# Altium schematic sheet 04_LMS7002M_Digital.SchDoc: LMS7002M digital circuit
size A3 portrait; Organization: Lime Microsystems; Address1: Surrey Tech Centre; Address2: Guildford GU2 7YG; Address3: Surrey; Address4: United Kingdom; Revision: v1.2; SheetNumber: 4; SheetTotal: 14
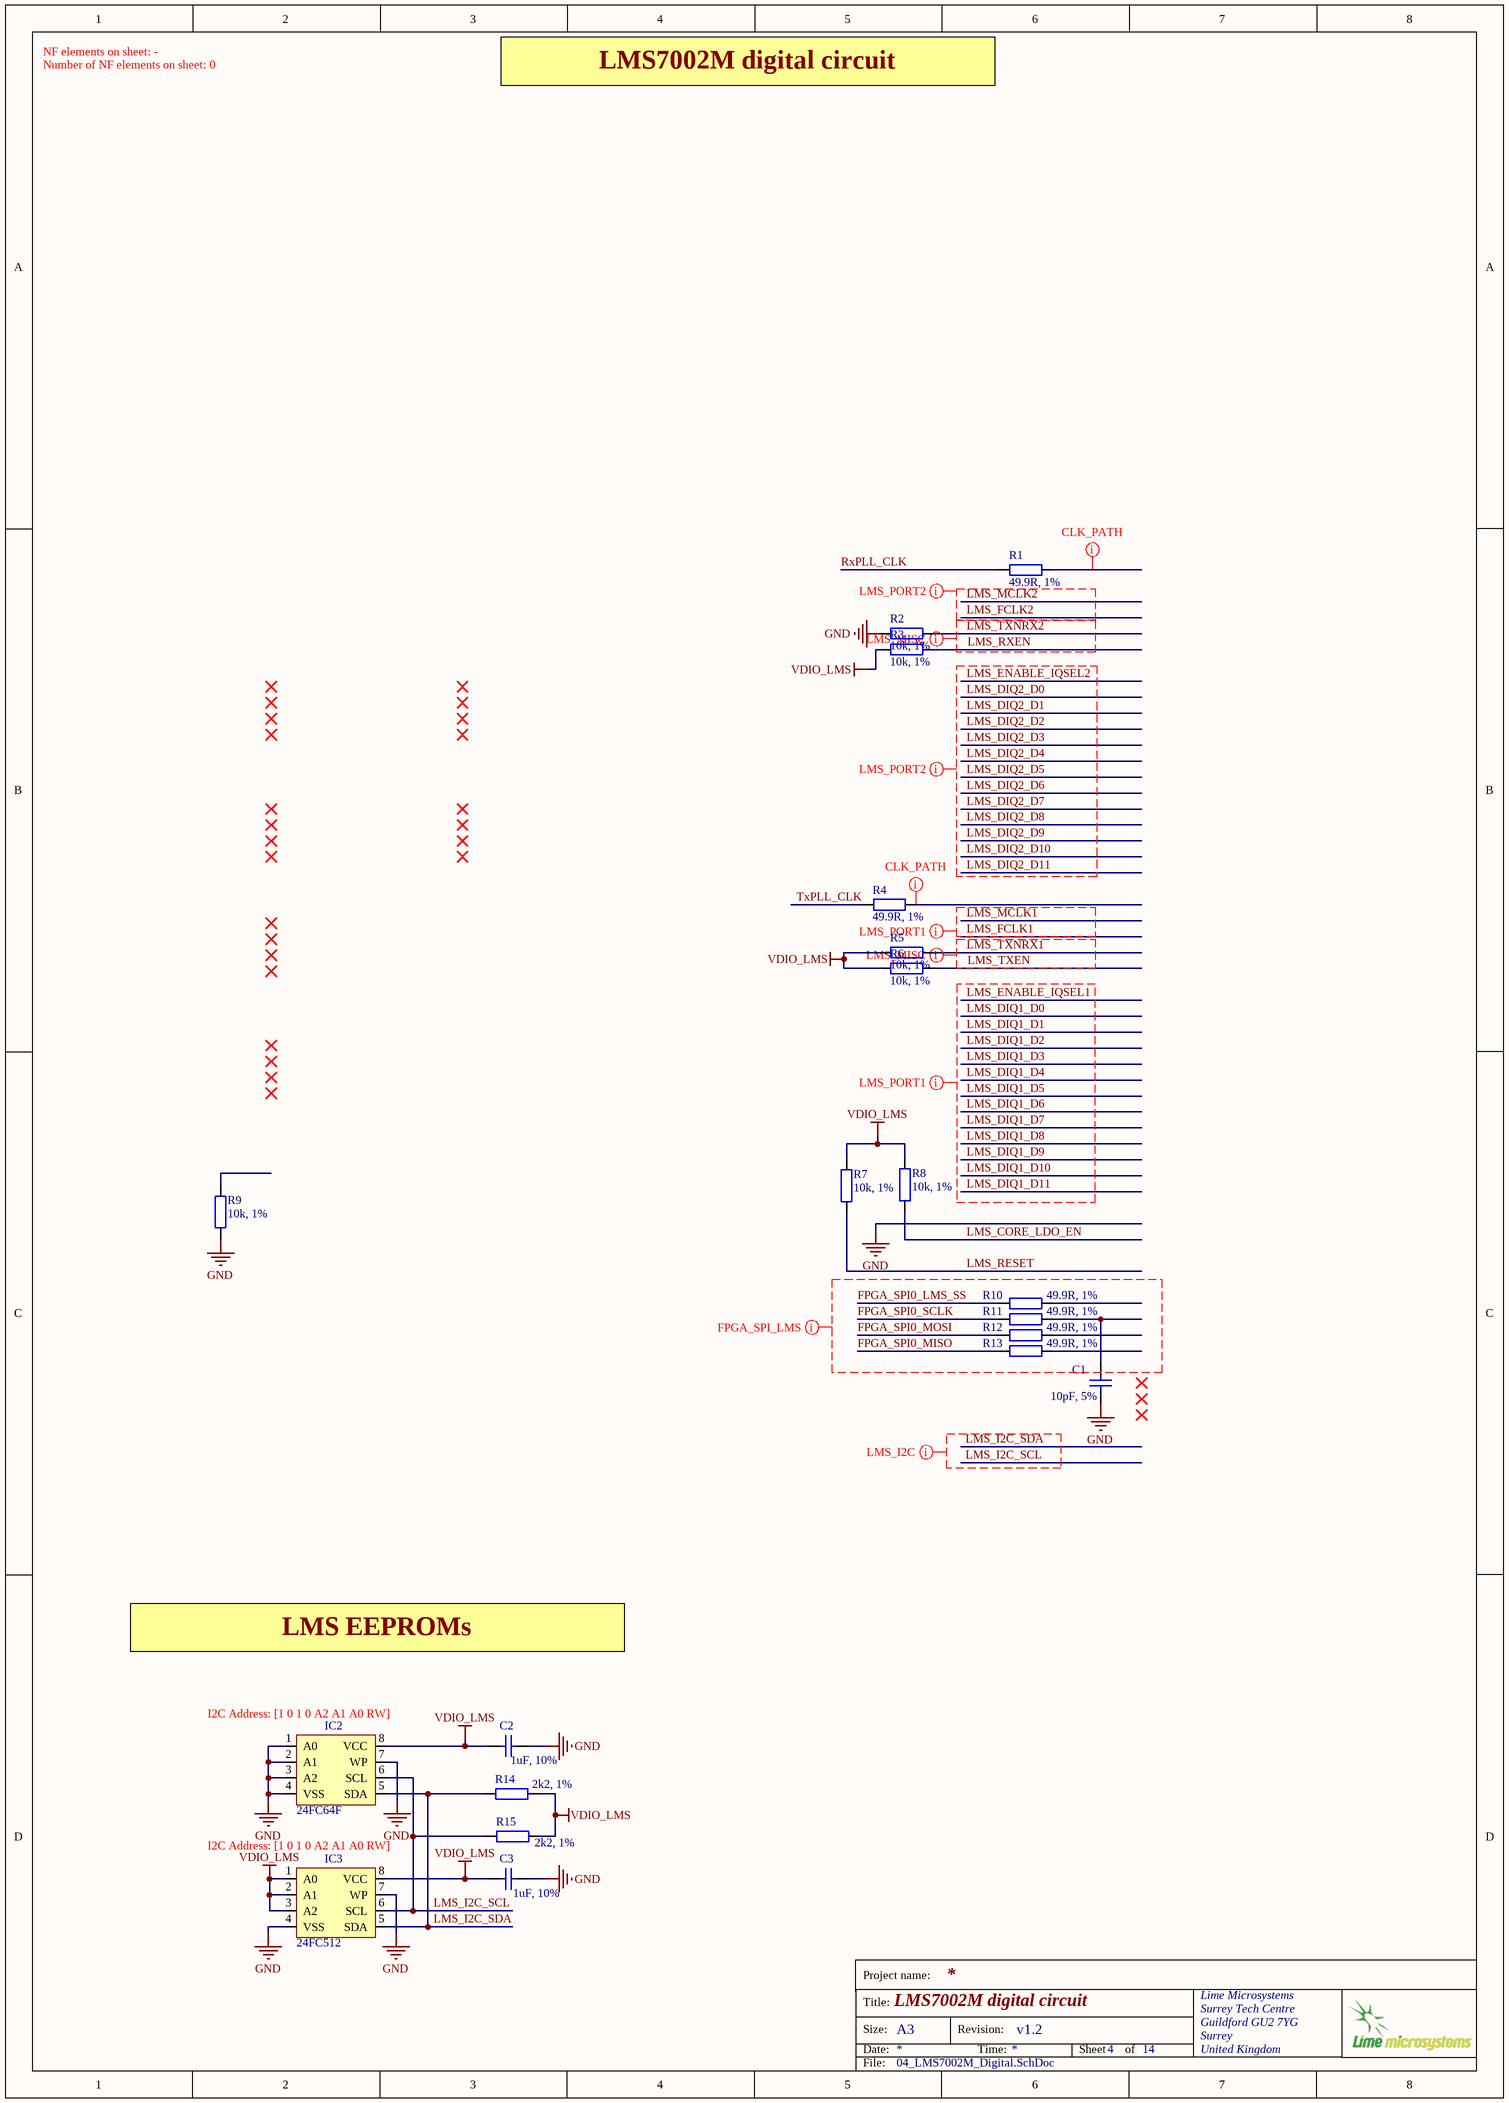
[diagram p0: 04_LMS7002M_Digital.SchDoc]

## Parts
C1  10pF, 5%  [CAP0402]
C2  1uF, 10%  [CAP0402]
C3  1uF, 10%  [CAP0402]
IC2  24FC64F  [24FC512]
IC3  24FC512  [24FC512]
R1  49.9R, 1%  [RES0402]
R2  10k, 1%  [RES0402]
R3  10k, 1%  [RES0402]
R4  49.9R, 1%  [RES0402]
R5  10k, 1%  [RES0402]
R6  10k, 1%  [RES0402]
R7  10k, 1%  [RES0402]
R8  10k, 1%  [RES0402]
R9  10k, 1%  [RES0402]
R10  49.9R, 1%  [RES0402]
R11  49.9R, 1%  [RES0402]
R12  49.9R, 1%  [RES0402]
R13  49.9R, 1%  [RES0402]
R14  2k2, 1%  [RES0402]
R15  2k2, 1%  [RES0402]

## Nets
GND: C1.2 C2.1 C3.1 IC2.1(A0) IC2.2(A1) IC2.3(A2) IC2.4(VSS) IC2.7(WP) IC3.4(VSS) IC3.7(WP) R2.1 R9.2
VDIO_LMS: C2.2 C3.2 IC2.8(VCC) IC3.1(A0) IC3.2(A1) IC3.3(A2) IC3.8(VCC) R3.1 R5.1 R6.1 R7.2 R8.2 R14.1 R15.1
FPGA_SPI0_LMS_SS: R10.2
FPGA_SPI0_MISO: R13.2
FPGA_SPI0_MOSI: R12.2
FPGA_SPI0_SCLK: R11.2
LMS_CORE_LDO_EN: R8.1
LMS_I2C_SCL: IC2.6(SCL) IC3.6(SCL) R15.2
LMS_I2C_SDA: IC2.5(SDA) IC3.5(SDA) R14.2
LMS_RESET: R7.1
LMS_RXEN: R3.2
LMS_TXEN: R6.2
LMS_TXNRX1: R5.2
LMS_TXNRX2: R2.2
RxPLL_CLK: R1.2
TxPLL_CLK: R4.2
NetC1_1: C1.1 R11.1

Not connected (* = marked no-connect by the designer): R1 1; R4 1; R9 1; R10 1; R12 1; R13 1

## Layout directives
net class CLK_PATH: NetR1_1, NetR4_1
net class FPGA_SPI_LMS: FPGA_SPI0_LMS_SS, FPGA_SPI0_MISO, FPGA_SPI0_MOSI, FPGA_SPI0_SCLK
net class LMS_I2C: LMS_I2C_SCL, LMS_I2C_SDA
net class LMS_MISC: LMS_RXEN, LMS_TXNRX1, LMS_TXNRX2
net class LMS_PORT2: LMS_DIQ2_D0, LMS_DIQ2_D1, LMS_DIQ2_D2, LMS_DIQ2_D3, LMS_DIQ2_D4, LMS_DIQ2_D5, LMS_DIQ2_D6, LMS_DIQ2_D7, LMS_DIQ2_D8, LMS_DIQ2_D9, LMS_DIQ2_D10, LMS_DIQ2_D11, LMS_ENABLE_IQSEL2, LMS_FCLK2, LMS_MCLK2
net class LMS_PORT1: LMS_DIQ1_D0, LMS_DIQ1_D1, LMS_DIQ1_D2, LMS_DIQ1_D3, LMS_DIQ1_D4, LMS_DIQ1_D5, LMS_DIQ1_D6, LMS_DIQ1_D7, LMS_DIQ1_D8, LMS_DIQ1_D9, LMS_DIQ1_D10, LMS_DIQ1_D11, LMS_ENABLE_IQSEL1, LMS_MCLK1

## Notes on the sheet
- NF elements on sheet: -
- Number of NF elements on sheet: 0
- LMS7002M digital circuit
- LMS EEPROMs
- (near IC2) I2C Address: [1 0 1 0 A2 A1 A0 RW]
- (near IC3) I2C Address: [1 0 1 0 A2 A1 A0 RW]
- Project name:
- Title:
- Size:
- Date:
- A3
- Revision:
- Time:
- Sheet
- of
- File:

## Library data of the parts
C1 = Cap_0402: Manufacturer Part Number 1: 04023A100JAT2A; Manufacturer: AVX; Part Description: 10pF ±5% 25V C0G, NP0, Ceramic Capacitor, Surface Mount, MLCC 0402; Voltage Rating: 25; Ceramic Capacitor Case: 0402 [1005 Metric]; Capacitor Case Style: 0402 [1005 Metric]<!--FANDB--><div class="features-and-benefits-container"></div>; Dielectric Characteristic: C0G / NP0; SVHC: No SVHC (16-Jun-2014); Capacitance: 10; Value: 10pF, 5%; Supplier 1: Farnell; Supplier Part Number 1: 2332478RL; Capacitance Tolerance: ± 5%; Product Range: -; RoHS: YES; Operating Temperature Min: -55; Operating Temperature Max: 125; Capacitance Tolerance ±: ± 5%; MSL: MSL 1 - Unlimited; Packaging: Cut Tape
C2 C3 = Cap_0402: Manufacturer Part Number 1: GRM155R61A105KE15J; Manufacturer: TDK; Part Description: 1µF ±10% 10V X5R Ceramic Capacitor -55°C ~ 85°C Surface Mount, MLCC 0402 (1005 Metric) 0.039" L x 0.020" W (1.00mm x 0.50mm); Voltage Rating: 10; Product Range: TDK - C Series; Ceramic Capacitor Case: 0402 [1005 Metric]; Capacitance: 1; Dielectric Characteristic: X6; Value: 1uF, 10%; Supplier 1: Newark; Supplier Part Number 1: 490-6298-2-ND; Capacitance Tolerance: ± 10%; MSL: -; RoHS: YES
IC2 = 24FC64F: Manufacturer Part Number 1: 24FC64F-I/ST; Manufacturer: Microchip Technology; Part Description: IC EEPROM 64KBIT 1MHZ 8TSSOP; Format - Memory: EEPROMs - Serial; Speed: 400kHz, 1MHz; Interface: I²C, 2-Wire Serial; Memory Type: EEPROM; Memory Size: 64K (8K x 8); Voltage - Supply: 1.7 V ~ 5.5 V; Supplier 1: Digi-Key; Packaging: Tube; Supplier Device Package: 8-TSSOP; Operating Temperature: -40°C ~ 85°C; RoHS: RoHS Compliant; Category: Integrated Circuits (ICs); Package / Case: 8-TSSOP (0.173", 4.40mm Width); Supplier Part Number 1: 24FC64F-I/ST-ND
IC3 = 24FC512: Manufacturer Part Number 1: 24FC512-I/ST; Manufacturer: Microchip Technology; Part Description: IC EEPROM 512KBIT 1MHZ 8TSSOP; Speed: 400kHz, 1MHz; Memory Type: EEPROM; Memory Size: 512K (64K x 8); Voltage - Supply: 1.7 V ~ 5.5 V; Interface: I²C, 2-Wire Serial; Format - Memory: EEPROMs - Serial; Supplier 1: Digi-Key; RoHS: RoHS Compliant; Packaging: Tube; Operating Temperature: -40°C ~ 85°C; Supplier Device Package: 8-TSSOP; Category: Integrated Circuits (ICs); Package / Case: 8-TSSOP (0.173", 4.40mm Width); Supplier Part Number 1: 24FC512-I/ST-ND
R1 R4 R10-R13 = Res_0402: Manufacturer: Samsung Electro-Mechanics America, Inc.; Manufacturer Part Number: RC1005F49R9CS; Part Description: RES SMD 49.9 OHM 1% 1/16W 0402; Temperature Coefficient: ±100ppm/°C; Resistance (Ohms): 49.9; Power (Watts): 0.063W, 1/16W; Number of Terminations: 2; Size / Dimension: 0.039" L x 0.020" W (1.00mm x 0.50mm); Supplier Device Package: 0402 (1005 Metric); RoHS: RoHS Compliant; Supplier Part Number 1: 1276-3469-6-ND; Features: -; Packaging: Digi-Reel®; Tolerance: ±1%; Height: 0.016" (0.40mm); Category: Resistors; Composition: Thick Film; Package / Case: 0402 (1005 Metric); Supplier 1: Digi-Key; Operating Temperature: -55°C ~ 155°C; Value: 49.9R, 1%
R2 R3 R5-R9 = Res_0402: Manufacturer: Yageo; Manufacturer Part Number 1: RC0402FR-0710KL; Part Description: RES SMD 10K OHM 1% 1/16W 0402; Temperature Coefficient: ±100ppm/°C; Power (Watts): 0.063W, 1/16W; Value: 10k, 1%; Supplier 1: Digi-Key; Supplier Part Number 1: 311-10.0KLRTR-ND; Resistance (Ohms): 10k; Packaging: Tape & Reel (TR); RoHS: RoHS Compliant; Package / Case: 0402 (1005 Metric); Tolerance: ±1%; Operating Temperature: -55°C ~ 155°C; Size / Dimension: 0.039" L x 0.020" W (1.00mm x 0.50mm); Number of Terminations: 2; Category: Resistors; Height: 0.016" (0.40mm); Supplier Device Package: 0402; Features: Moisture Resistant; Composition: Thick Film
R14 R15 = Res_0402: Manufacturer: Stackpole Electronics Inc; Manufacturer Part Number 1: RMCF0402FT2K20; Part Description: RES SMD 2.2K OHM 1% 1/16W 0402; Resistance (Ohms): 2.2k; Temperature Coefficient: ±100ppm/°C; Power (Watts): 0.063W, 1/16W; Value: 2k2, 1%; Supplier 1: Digi-Key; Supplier Part Number 1: RMCF0402FT2K20CT-ND; Supplier Device Package: 0402; Package / Case: 0402 (1005 Metric); Size / Dimension: 0.039" L x 0.020" W (1.00mm x 0.50mm); Operating Temperature: -55°C ~ 155°C; Composition: Thick Film; Category: Resistors; Features: -; Height: 0.016" (0.40mm); RoHS: RoHS Compliant; Number of Terminations: 2; Packaging: Cut Tape (CT); Tolerance: ±1%